# Altium schematic sheet FETs.SchDoc
size A
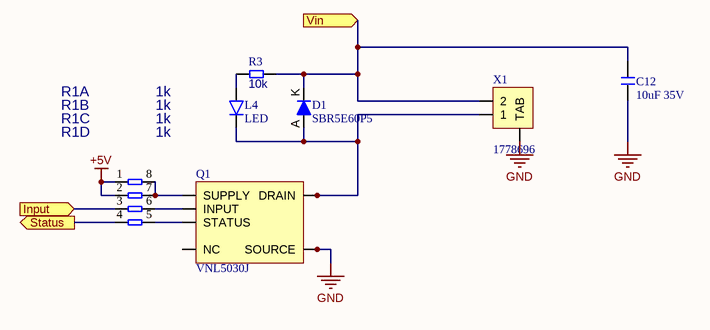
[diagram p0: FETs.SchDoc]

## Parts
C12  10uF 35V  [C1210_N]
D1  SBR5E60P5  [PowerDI5]
L4  LED  [LED 0603 Reverse]
Q1  VNL5030J  [PowerSSO-12]
R1  1k  [YC164]  (parts A,B,C,D of 4)
R3  10k  [R0603]
X1  1778696  [PTSM-2W-V-SMD]

## Ports
Input (in), Status (out), Vin (in)

## Nets
+5V: R1.1 R1.2
GND: C12.2 Q1.7(SOURCE) Q1.8(SOURCE) Q1.9(SOURCE) Q1.10(SOURCE) Q1.11(SOURCE) Q1.12(SOURCE) X1.TAB
Input: R1.3 ; port Input
Status: R1.4 ; port Status
Vin: C12.1 D1.K R3.2 X1.2 ; port Vin
NetD1_A: D1.A L4.1(K) Q1.1(DRAIN) Q1.6(DRAIN) Q1.PAD(DRAIN) X1.1
NetL4_2: L4.2(A) R3.1
NetQ1_2: Q1.2(SUPPLY) R1.7 R1.8
NetQ1_3: Q1.3(INPUT) R1.6
NetQ1_4: Q1.4(STATUS) R1.5

Not connected (* = marked no-connect by the designer): Q1 5(NC)

## Library data of the parts
C12 = Capacitor: Capacitor MLCC; Manufacturer: Yageo; Manufacturer Part Number: CC0603KRX7R9BB104; Tolerance (%): 10; Category: Capacitor; Package: 0603; Value: 10uF 35V; Supplier Part Number 1: 1362556; Supplier 1: Farnell; ComponentLink1URL: http://www.yageo.com; ComponentLink1Description: Manufacturer Website; Voltage Rating (Volts): *; Supplier 2: Digi-Key; Supplier Part Number 2: 311-1344-1-ND
D1 = Diode
Q1 = VNL5030JTR
R1 = Resistor Array - 4P: Value: *
R3 = Resistor: Published: 17-Dec-2003; LatestRevisionDate: 19-Mar-2004; LatestRevisionNote: Silkscreen size reduced.; PackageDocument: Mar-2003; PackageReference: 3-0603; Publisher: Altium Limited; Code_IPC: 1608 [0603]; ComponentLink1Description: Manufacturer Link; ComponentLink1URL: http://www.panasonic.com/industrial/components/resistive_products.htm; ComponentLink2Description: Datasheet; ComponentLink2URL: http://www.panasonic.com/industrial/components/pdf/AOA0000CE2.pdf; Value: 10k
X1 = Connector 2W - TAB